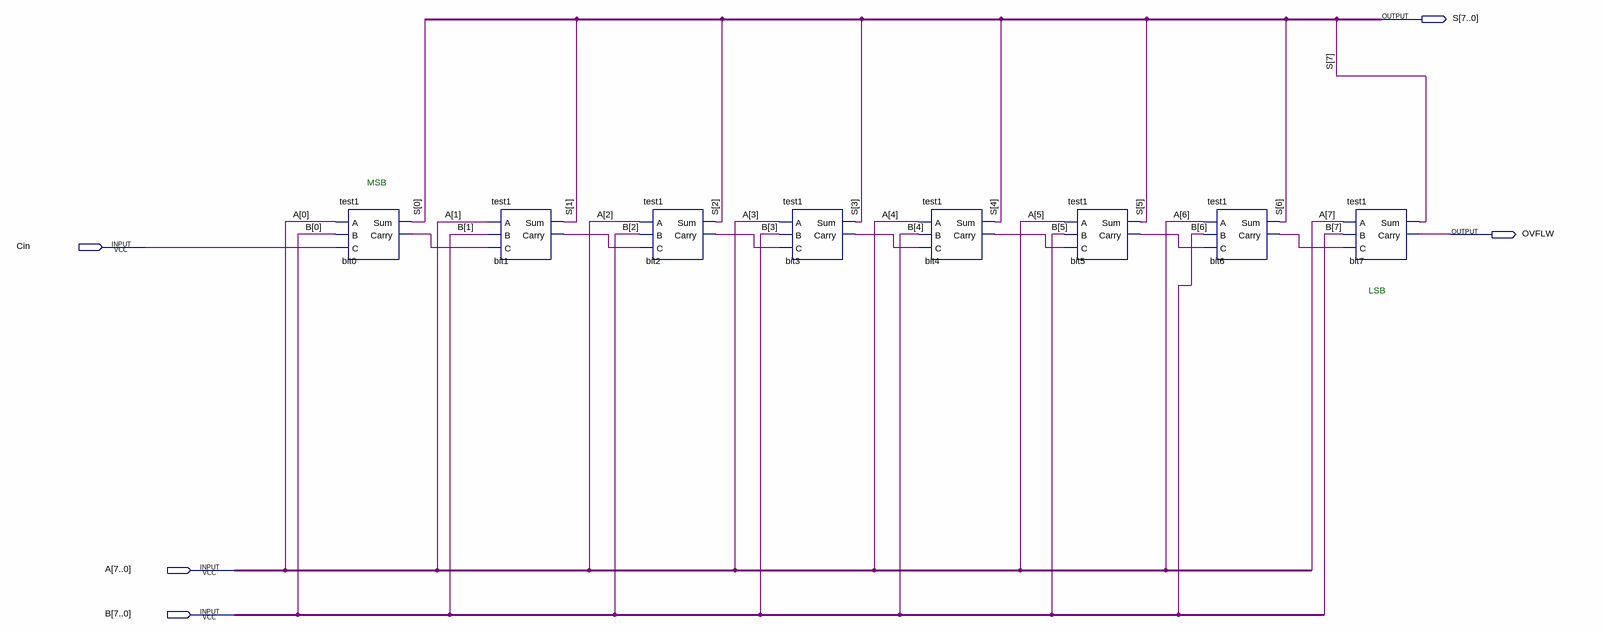
[diagram p0: schematic sheet]
// Quartus schematic 8bitRCA.bdf as structural Verilog: 8 symbols, 5 pins
module \8bitRCA  (
  input  Cin,
  input  [7:0] A,
  input  [7:0] B,
  output [7:0] S,
  output OVFLW
);

  wire bit0_carry, bit1_carry, bit2_carry, bit3_carry, bit4_carry, bit5_carry, bit6_carry;

  test1 bit0 (.A(A[0]), .B(B[0]), .C(Cin), .Sum(S[0]), .Carry(bit0_carry));
  test1 bit1 (.A(A[1]), .B(B[1]), .C(bit0_carry), .Sum(S[1]), .Carry(bit1_carry));
  test1 bit2 (.A(A[2]), .B(B[2]), .C(bit1_carry), .Sum(S[2]), .Carry(bit2_carry));
  test1 bit3 (.A(A[3]), .B(B[3]), .C(bit2_carry), .Sum(S[3]), .Carry(bit3_carry));
  test1 bit4 (.A(A[4]), .B(B[4]), .C(bit3_carry), .Sum(S[4]), .Carry(bit4_carry));
  test1 bit5 (.A(A[5]), .B(B[5]), .C(bit4_carry), .Sum(S[5]), .Carry(bit5_carry));
  test1 bit6 (.A(A[6]), .B(B[6]), .C(bit5_carry), .Sum(S[6]), .Carry(bit6_carry));
  test1 bit7 (.A(A[7]), .B(B[7]), .C(bit6_carry), .Sum(S[7]), .Carry(OVFLW));

  // Notes on the sheet:
  //   MSB
  //   LSB
endmodule
